# Altium schematic sheet [1]DotexBoard_MCU.SchDoc
size B
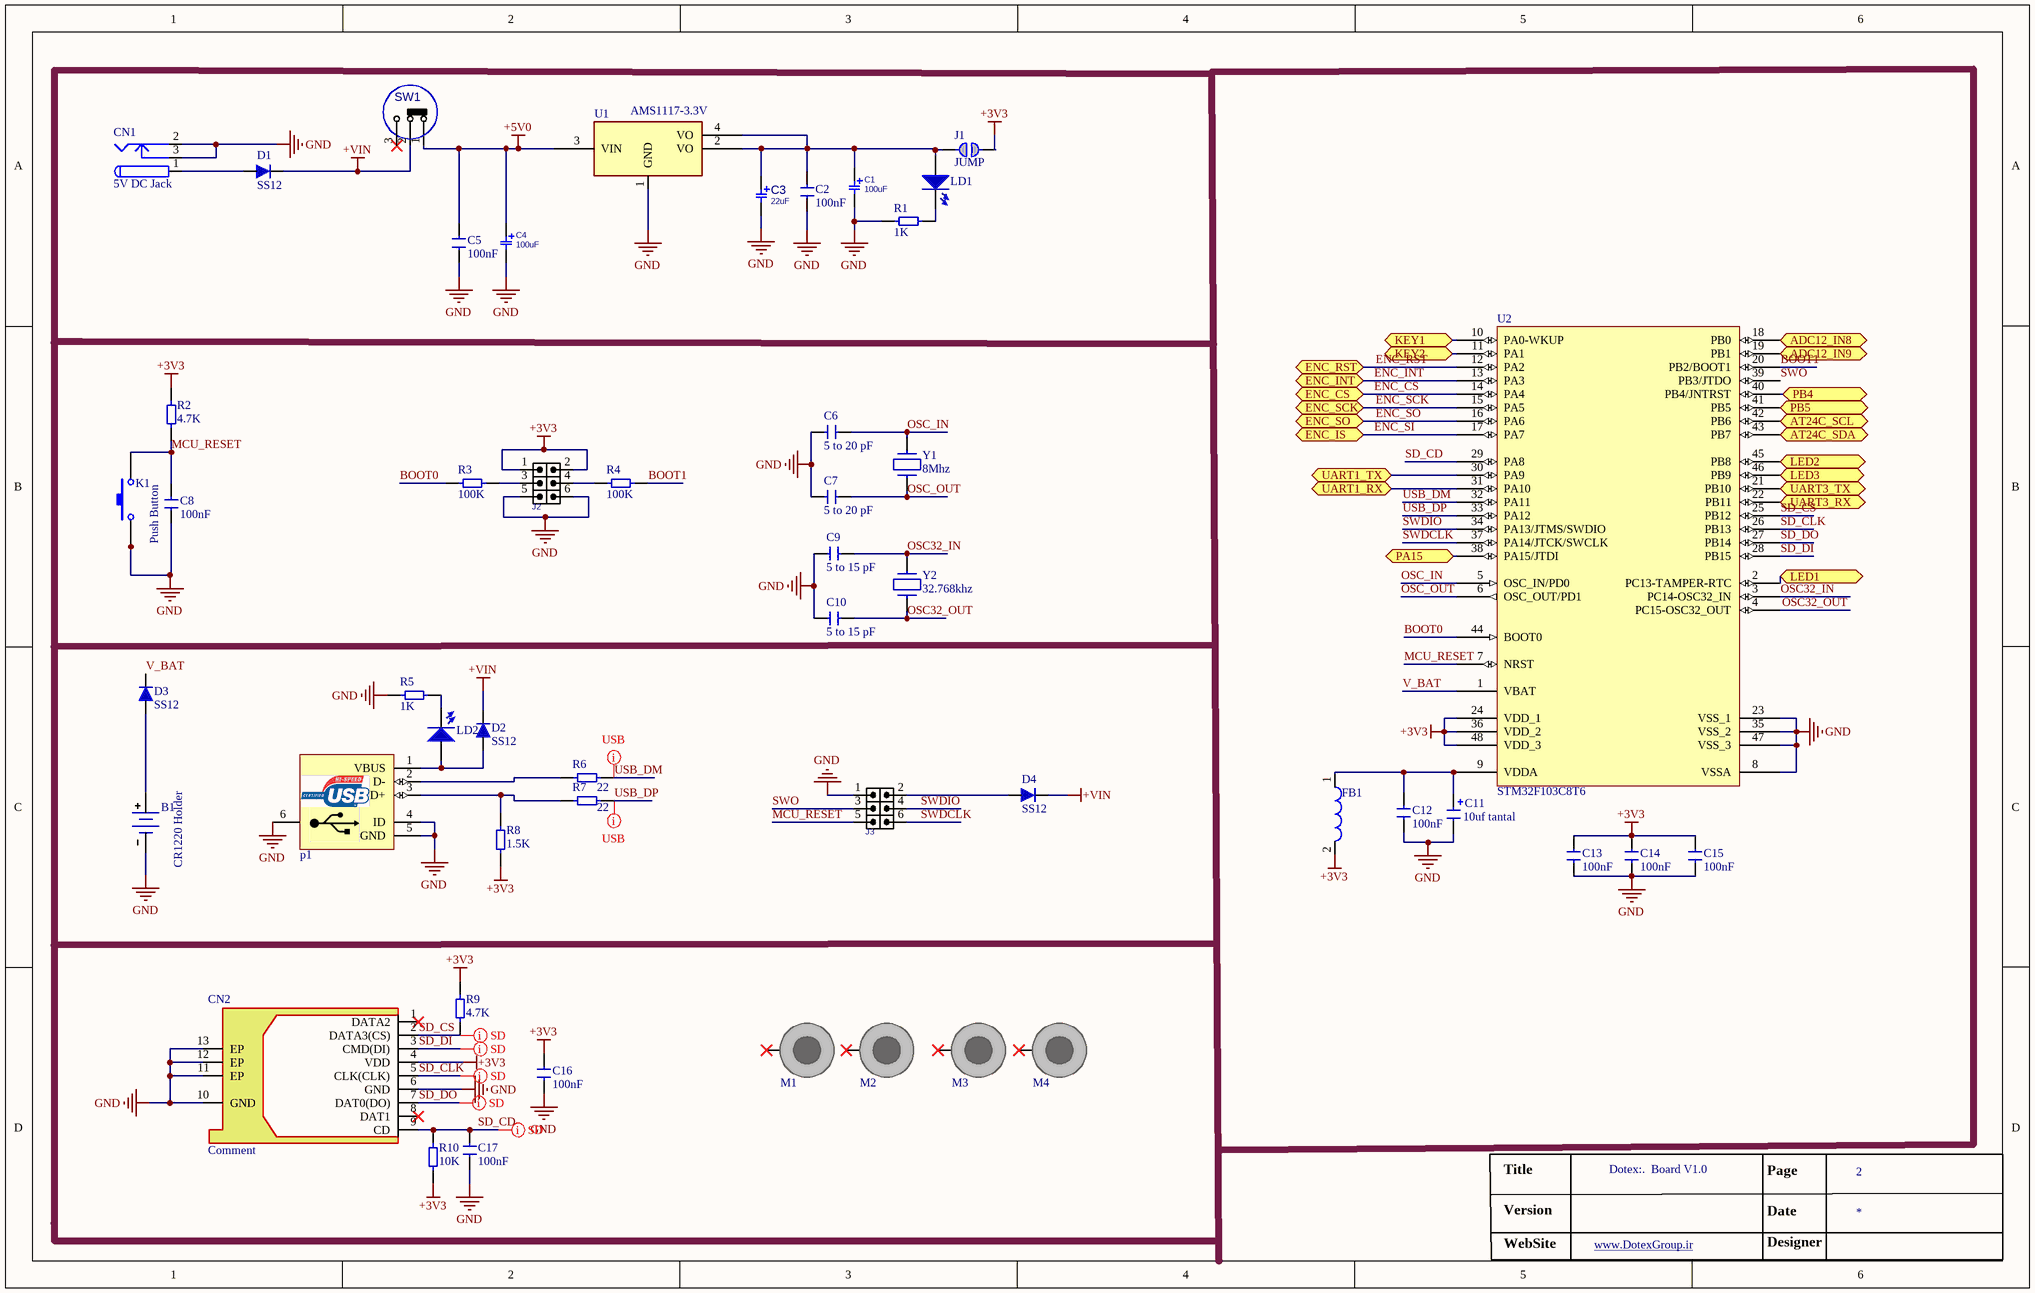
[diagram p0: [1]DotexBoard_MCU.SchDoc]

## Parts
B1  CR1220 Holder  [Battery socket SMD]
C1  value 100uF  [C_EL_6_6]  (hidden comment: Comment)
C2  Comment  [0805 Capacitor]  (value not drawn)
C3  22uF  [C_EL_5]
C4  value 100uF  [C_EL_6_6]  (hidden comment: Comment)
C5  Comment  [0805 Capacitor]  (value not drawn)
C6  Comment  [0805 Capacitor]  (value not drawn)
C7  Comment  [0805 Capacitor]  (value not drawn)
C8  Comment  [0805 Capacitor]  (value not drawn)
C9  Comment  [0805 Capacitor]  (value not drawn)
C10  Comment  [0805 Capacitor]  (value not drawn)
C11  10uf tantal  [Tantalium Size A]
C12  Comment  [0805 Capacitor]  (value not drawn)
C13  Comment  [0805 Capacitor]  (value not drawn)
C14  Comment  [0805 Capacitor]  (value not drawn)
C15  Comment  [0805 Capacitor]  (value not drawn)
C16  Comment  [0805 Capacitor]  (value not drawn)
C17  Comment  [0805 Capacitor]  (value not drawn)
CN1  5V DC Jack  [Power Jack]
CN2  Comment  [Micro SD Card]
D1  SS12  [DO-214AC(SMA)]
D2  SS12  [DO-214AC(SMA)]
D3  SS12  [DO-214AC(SMA)]
D4  SS12  [DO-214AC(SMA)]
FB1  Comment  [0805 Ferrit Bead]  (value not drawn)
J1  JUMP  [0805 Capacitor]
J2  HDRM_2X3  [HDR_M_2X3]  (value not drawn)
J3  HDRM_2X3  [HDR_M_2X3]  (value not drawn)
K1  Push Button  [Push Kay 4 KFC]
LD1  LED  [LED_0805 Y]  (value not drawn)
LD2  LED  [LED_0805 Y]  (value not drawn)
M1  Comment  [SCMH_M3]  (value not drawn)  (no BOM)
M2  Comment  [SCMH_M3]  (value not drawn)  (no BOM)
M3  Comment  [SCMH_M3]  (value not drawn)  (no BOM)
M4  Comment  [SCMH_M3]  (value not drawn)  (no BOM)
p1  USB Connector  [USB_AB_BM_SHS]  (value not drawn)
R1  Comment  [0805 Resistor]  (value not drawn)
R2  Comment  [0805 Resistor]  (value not drawn)
R3  Comment  [0805 Resistor]  (value not drawn)
R4  Comment  [0805 Resistor]  (value not drawn)
R5  Comment  [0805 Resistor]  (value not drawn)
R6  Comment  [0805 Resistor]  (value not drawn)
R7  Comment  [0805 Resistor]  (value not drawn)
R8  Comment  [0805 Resistor]  (value not drawn)
R9  Comment  [0805 Resistor]  (value not drawn)
R10  Comment  [0805 Resistor]  (value not drawn)
SW1  SlideSwitch  [SWSLIDT_SPDT_R_8X4]  (value not drawn)
U1  value AMS1117-3.3V  [SOT223_4]  (hidden comment: Comment)
U2  STM32F103C8T6  [LQFP48_N]
Y1  8Mhz  [Xtal 2p]
Y2  32.768khz  [Xtal 32.782khz]

## Ports
ADC12_IN8 (bidir), ADC12_IN9 (bidir), AT24C_SCL (bidir), AT24C_SDA (bidir), ENC_CS (bidir), ENC_INT (bidir), ENC_IS (bidir), ENC_RST (bidir), ENC_SCK (bidir), ENC_SO (bidir), KEY1 (bidir), KEY2 (bidir), LED1 (bidir), LED2 (bidir), LED3 (bidir), PA15 (bidir), PB4 (bidir), PB5 (bidir), UART1_RX (bidir), UART1_TX (bidir), UART3_RX (bidir), UART3_TX (bidir)

## Nets
+3V3: C13.2 C14.2 C15.2 C16.2 CN2.4(VDD) FB1.2 J1.2 J2.1 J2.2 R2.1 R8.1 R9.1 R10.2 U2.24(VDD_1) U2.36(VDD_2) U2.48(VDD_3)
+5V0: C4.1 C5.2 SW1.1(P1) U1.3(VIN)
+VIN: D1.2(K) D2.2(K) D4.2(K) SW1.2(P3)
GND: B1.2(-) C1.2 C2.1 C3.2 C4.2 C5.1 C6.1 C7.2 C8.2 C9.1 C10.2 C11.2 C12.1 C13.1 C14.1 C15.1 C16.1 C17.2 CN1.2 CN1.3 CN2.6(GND) CN2.10(GND) CN2.11(EP) CN2.12(EP) CN2.13(EP) J2.5 J2.6 J3.1 K1.1 p1.4(ID) p1.5(GND) p1.6(MH) R1.2 R5.2 U1.1(GND) U2.8(VSSA) U2.23(VSS_1) U2.35(VSS_2) U2.47(VSS_3)
ADC12_IN8: U2.18(PB0) ; port ADC12_IN8
ADC12_IN9: U2.19(PB1) ; port ADC12_IN9
AT24C_SCL: U2.42(PB6) ; port AT24C_SCL
AT24C_SDA: U2.43(PB7) ; port AT24C_SDA
BOOT0: R3.1 U2.44(BOOT0)
BOOT1: R4.2 U2.20(PB2/BOOT1)
ENC_CS: U2.14(PA4) ; port ENC_CS
ENC_INT: U2.13(PA3) ; port ENC_INT
ENC_RST: U2.12(PA2) ; port ENC_RST
ENC_SCK: U2.15(PA5) ; port ENC_SCK
ENC_SI: U2.17(PA7) ; port ENC_IS
ENC_SO: U2.16(PA6) ; port ENC_SO
KEY1: U2.10(PA0-WKUP) ; port KEY1
KEY2: U2.11(PA1) ; port KEY2
LED1: U2.2(PC13-TAMPER-RTC) ; port LED1
LED2: U2.45(PB8) ; port LED2
LED3: U2.46(PB9) ; port LED3
MCU_RESET: C8.1 J3.5 K1.2 R2.2 U2.7(NRST)
OSC32_IN: C9.2 U2.3(PC14-OSC32_IN) Y2.1
OSC32_OUT: C10.1 U2.4(PC15-OSC32_OUT) Y2.2
OSC_IN: C6.2 U2.5(OSC_IN/PD0) Y1.2
OSC_OUT: C7.1 U2.6(OSC_OUT/PD1) Y1.1
PA15: U2.38(PA15/JTDI) ; port PA15
PB4: U2.40(PB4/JNTRST) ; port PB4
PB5: U2.41(PB5) ; port PB5
SD_CD: C17.1 CN2.9(CD) R10.1 U2.29(PA8)
SD_CLK: CN2.5(CLK(CLK)) U2.26(PB13)
SD_CS: CN2.2(DATA3(CS)) R9.2 U2.25(PB12)
SD_DI: CN2.3(CMD(DI)) U2.28(PB15)
SD_DO: CN2.7(DAT0(DO)) U2.27(PB14)
SWDCLK: J3.6 U2.37(PA14/JTCK/SWCLK)
SWDIO: J3.4 U2.34(PA13/JTMS/SWDIO)
SWO: J3.3 U2.39(PB3/JTDO)
UART1_RX: U2.31(PA10) ; port UART1_RX
UART1_TX: U2.30(PA9) ; port UART1_TX
UART3_RX: U2.22(PB11) ; port UART3_RX
UART3_TX: U2.21(PB10) ; port UART3_TX
USB_DM: R6.2 U2.32(PA11)
USB_DP: R7.2 U2.33(PA12)
V_BAT: D3.2(K) U2.1(VBAT)
NetB1_1: B1.1(+) D3.1(A)
NetC1_1: C1.1 C2.2 C3.1 J1.1 LD1.1(A) U1.2(VO) U1.4(VO)
NetC11_1: C11.1 C12.2 FB1.1 U2.9(VDDA)
NetCN1_1: CN1.1 D1.1(A)
NetD2_1: D2.1(A) LD2.1(A) p1.1(VBUS)
NetD4_1: D4.1(A) J3.2
NetJ2_3: J2.3 R3.2
NetJ2_4: J2.4 R4.1
NetLD1_2: LD1.2(K) R1.1
NetLD2_2: LD2.2(K) R5.1
Netp1_2: p1.2(D-) R6.1
Netp1_3: p1.3(D+) R7.1 R8.2

Not connected (* = marked no-connect by the designer): CN2 1(DATA2)* 8(DAT1)*; M1 1*; M2 1*; M3 1*; M4 1*; SW1 3(P4)*

## Layout directives
net class SD_card: SD_CD, SD_CLK, SD_CS, SD_DI, SD_DO
net class USB: USB_DM, USB_DP

## Notes on the sheet
- Title
- Dotex:.  Board V1.0
- Page
- 2
- Version
- WebSite
- www.DotexGroup.ir <http://www.DotexGwww.DotexGroup.irroup.ir>
- Date
- Designer
- (in symbol Capacitor SMD) 100nF; 5 to 20 pF; 5 to 15 pF
- (in symbol Resistor SMD) 1K; 4.7K; 100K; 22; 1.5K; 10K

## Library data of the parts
B1 = Battry Backup
C1 C4 = CAP_THD_EL_10u25V: CAP, THD, ELEC, 10uF, 25V; MANF_P#: MANF_PART#; PARAM: 25V; MANF: MANF; PARAM2: PARAM2
C2 C5-C10 C12-C17 = Capacitor SMD
C3 = CAP_SMD_EL_100u10V: CAP, SMDD, ELEC, 100uF, 10V; MANF_P#: 875105242010; MANF: Wurth Electronics; DESC: Aluminum Organic Polymer; DIST#: MOUSER; PARAM: 20%, 30mOhmESR, -55~105oC; PRICE: 0.56$; PARAM2: 10V; ASSEMBLY: ASSEMBLY; VALUE: 22uF
C11 = Capacitor Tantalium
CN1 = Power Jack
CN2 = Micro SD Card
D1-D4 = 1N4001
FB1 = Ferrit Bead
J1 = jumper SMD
J2 J3 = HDR_M_2X3: CONN, HEADER, Male, pitch: 2.54mm, 6POS; MANF_P#: MANF_PART#; MANF: MANF; VALUE: HDRM_2X3
K1 = Push Kay
LD1 LD2 = LED SMD
M1-M4 = SCMH_M1P6: SCREW mouting, M1.6, 1.6mm diameter and 3.2mm PanHead; VALUE: DNP/MH; ASSEMBLY: DNP
p1 = USB AB MICRO CONNECTOR: USB MICRO-B Type Connector; Designer: ABBAS BASEREH; Max Current: 1600mA; Mounting Technology: Surface Mount\Through-Hole; Category: Connector; Pin Count: 5-7; Publisher: ABBAS BASEREH; Status: Unreleased; ComponentLink1Description: Datasheet; ComponentLink2Description: Reference; Update: 1395-11-17
R1-R10 = Resistor SMD
SW1 = SWSLIDT_SPDT_S_8X4: SWITCH, SLIDE, SPDT, 8.6X4.3mm, THD; MANF_PART#: OS102011MS2QN1; MANF: C&K; DESC: DESCRIPTION; VALUE: SlideSwitch; ASSEMBLY: ASSEMBLY; PARAM: PARAM; PRICE: 0.4$
U1 = VREG_1117_SOT223: REG, Linear, LDO1V, 0.8A, SOT-223; MANF_P#: LD1117, LM1117, AMS1117, TLV1117, REG1117, NCP1117, LT1117, SPX1117; MANF: TI, ON, ST; PARAM2: 1.2/1.5/1.8/2.5/2.85/3.3/5V; PARAM: LDO1V, 0.8A
U2 = STM32F103C8T6: STM32 ARM-based 32-bit MCU with 64 Kbytes Flash, 48-pin LQFP, Industrial Temperature; Published: 30-May-2008; DatasheetVersion: rev6, Mar-2008; PackageVersion: Mar-2008; PackageReference: LQFP48; Publisher: Altium Limited; PackageDescription: 48-Pin Low-Profile Quad Flat Pack, 7 x 7 mm Body, 0.5 mm Pitch (LQFP48); ComponentLink1Description: Manufacturer Link; ComponentLink1URL: www.st.com/stm32; ComponentLink2Description: Datasheet; ComponentLink2URL: http://www.st.com/stonline/products/literature/ds/13587.pdf
Y1 Y2 = Xtal